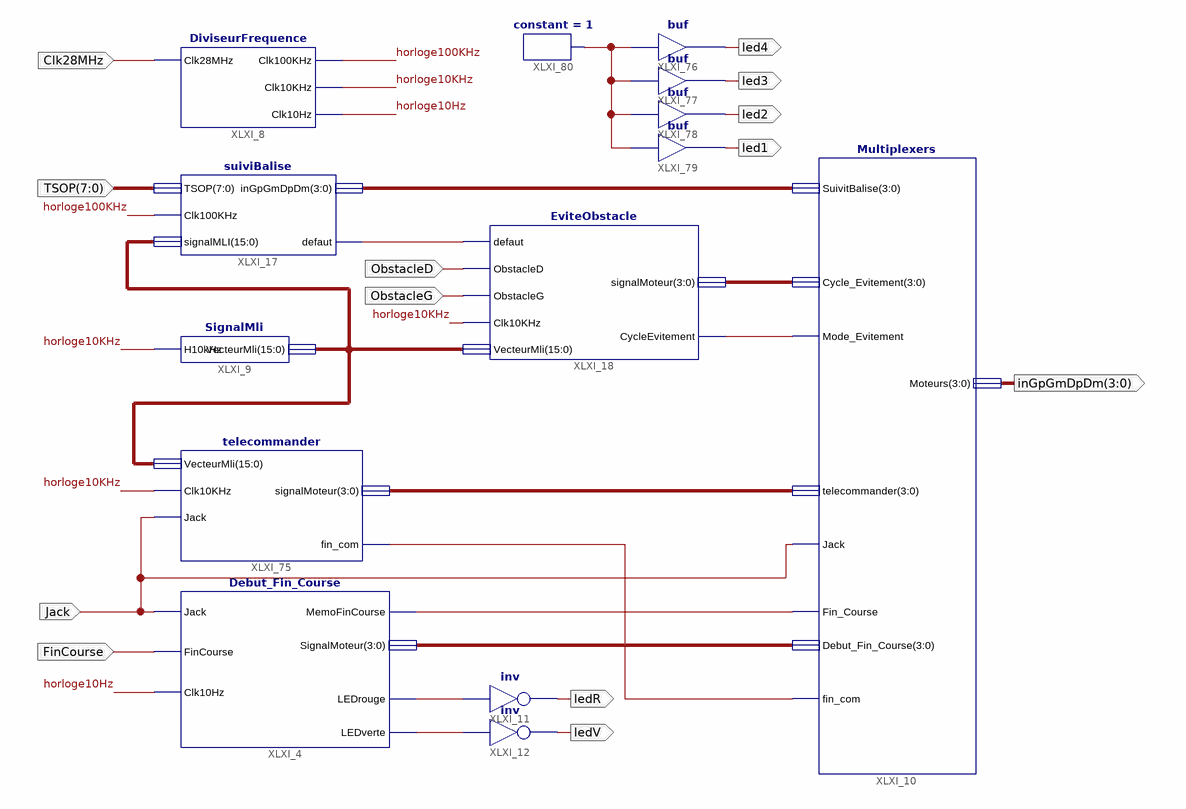
[diagram p0: schematic sheet 1]
// Xilinx ISE schematic schemasComplet.sch (spartan3a) as structural Verilog: 14 symbols, 13 ports
module schemasComplet (
  input  Clk28MHz,
  input  ObstacleD,
  input  ObstacleG,
  input  [7:0] TSOP,
  input  FinCourse,
  input  Jack,
  output [3:0] inGpGmDpDm,
  output ledV,
  output ledR,
  output led1,
  output led2,
  output led3,
  output led4
);

  wire horloge10Hz, horloge10KHz, horloge100KHz, XLXN_26, XLXN_27, XLXN_178, XLXN_184, XLXN_390, XLXN_393,
       XLXN_397;
  wire [3:0] XLXN_177, XLXN_183, XLXN_389, XLXN_391;
  wire [15:0] XLXN_377;

  DiviseurFrequence XLXI_8 (
    .Clk28MHz(Clk28MHz), .Clk10KHz(horloge10KHz), .Clk10Hz(horloge10Hz), .Clk100KHz(horloge100KHz));
  suiviBalise XLXI_17 (
    .signalMLI(XLXN_377), .TSOP(TSOP), .Clk100KHz(horloge100KHz), .inGpGmDpDm(XLXN_177), .defaut(XLXN_178));
  EviteObstacle XLXI_18 (
    .defaut(XLXN_178), .Clk10KHz(horloge10KHz), .ObstacleD(ObstacleD), .ObstacleG(ObstacleG),
    .VecteurMli(XLXN_377), .CycleEvitement(XLXN_184), .signalMoteur(XLXN_183));
  Multiplexers XLXI_10 (
    .Jack(Jack), .Mode_Evitement(XLXN_184), .Fin_Course(XLXN_390), .fin_com(XLXN_397),
    .SuivitBalise(XLXN_177), .Cycle_Evitement(XLXN_183), .Debut_Fin_Course(XLXN_389),
    .telecommander(XLXN_391), .Moteurs(inGpGmDpDm));
  SignalMli XLXI_9 (.H10kHz(horloge10KHz), .VecteurMli(XLXN_377));
  not XLXI_12 (ledV, XLXN_27);
  not XLXI_11 (ledR, XLXN_26);
  Debut_Fin_Course XLXI_4 (
    .Jack(Jack), .FinCourse(FinCourse), .Clk10Hz(horloge10Hz), .LEDrouge(XLXN_26), .LEDverte(XLXN_27),
    .MemoFinCourse(XLXN_390), .SignalMoteur(XLXN_389));
  telecommander XLXI_75 (
    .Clk10KHz(horloge10KHz), .Jack(Jack), .VecteurMli(XLXN_377), .fin_com(XLXN_397), .signalMoteur(XLXN_391));
  buf XLXI_79 (led1, XLXN_393);
  constant #(.CValue("1")) XLXI_80 (.O(XLXN_393));
  buf XLXI_78 (led2, XLXN_393);
  buf XLXI_77 (led3, XLXN_393);
  buf XLXI_76 (led4, XLXN_393);
endmodule
